# EAGLE design esp-adap (EAGLE 8.0.0)
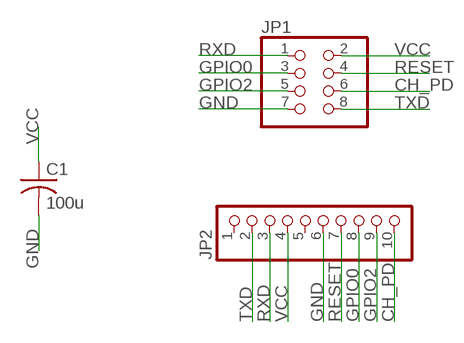
[diagram p0: schematic, sheet 1]

## Parts
C1  100u  C-USC1206K  [C1206K]
JP1  PINHD-2X4  [2X04]
JP2  PINHD-1X10  [1X10]

## Nets
CH_PD: JP1.6 JP2.10
GND: C1.2 JP1.7 JP2.6
GPIO0: JP1.3 JP2.8
GPIO2: JP1.5 JP2.9
RESET: JP1.4 JP2.7
RXD: JP1.1 JP2.3
TXD: JP1.8 JP2.2
VCC: C1.1 JP1.2 JP2.4
Unconnected: JP2.1 JP2.5

## Library data of the parts
C1 = resistor:C-US: CAPACITOR, American symbol
JP1 = pinhead:PINHD-2X4: PIN HEADER
JP2 = pinhead:PINHD-1X10: PIN HEADER

## Board
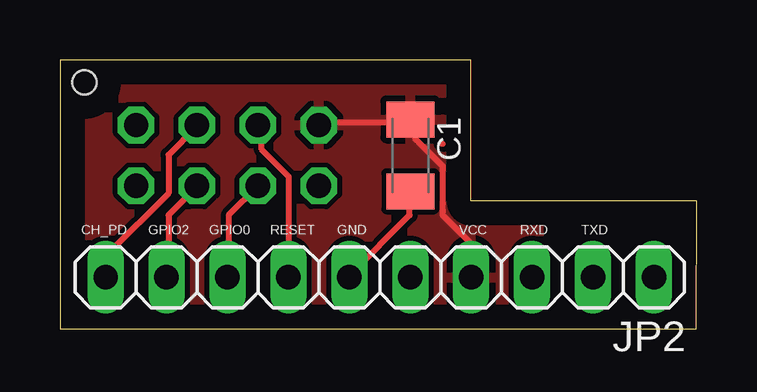
[diagram p1: board, top side]
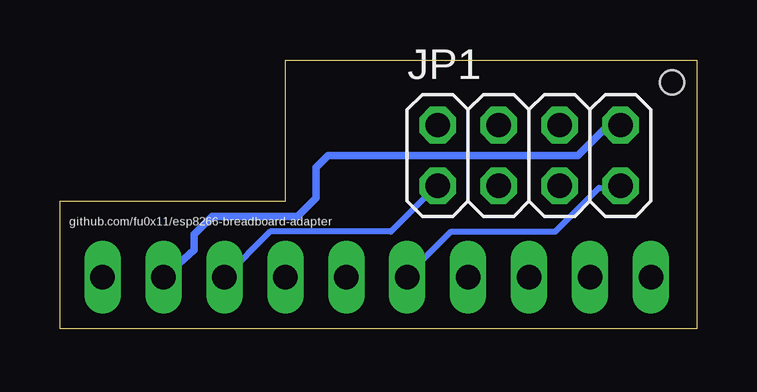
[diagram p2: board, bottom side, seen from below]

Size 26.54 x 11.23 mm. Coordinates in mm from the lower left corner, seen from the top.
Outline: 0,0 26.52,0 26.54,5.33 17.15,5.33 17.15,11.23 0,11.23 0,0
Copper layers (1*16): Top 0.035mm / dielectric 1.5mm / Bottom 0.035mm
Design rules "default": minimum track width 10mil, minimum drill 24mil, track to track 8mil, track to pad 8mil, pad to pad 8mil, via to via 8mil, smd to smd 8mil, copper to edge 40mil, drill to drill 8mil, minimum pad ring 10mil, minimum via ring 8mil, stop-mask expansion 4mil, vias tented up to drill 0mil, thermal gap 10mil
Holes 1 mm at 1.02,10.29

### Footprints (pad centres in the part's own frame; a part is rotated, then mirrored left to right if it is on the bottom)
C1206K = smd 1.5 x 2: 1 -1.5,0; 2 1.5,0
2X04 = drill 1.016 octagon: 1 -3.81,-1.27; 2 -3.81,1.27; 3 -1.27,-1.27; 4 -1.27,1.27; 5 1.27,-1.27; 6 1.27,1.27; 7 3.81,-1.27; 8 3.81,1.27
1X10 = drill 1.016 long: 1 -11.43,0; 2 -8.89,0; 3 -6.35,0; 4 -3.81,0; 5 -1.27,0; 6 1.27,0; 7 3.81,0; 8 6.35,0; 9 8.89,0; 10 11.43,0

### Placement (x,y rotation side)
C1  14.61,7.24 270 top
JP1  6.98,7.24 0 bottom
JP2  13.33,2.16 180 top

### Tracks (layer width: path | path; a pad name or v marks a point on that pad's centre or on a via)
CH_PD
  Top 0.254: JP2.10 2.01,2.24 2.01,3.15 4.52,5.66 4.52,7.26 5.66,8.41 JP1.6
GND
  Top 0.254: C1.2 14.58,5.66 14.58,4.75 12.06,2.24 JP2.6
  Bottom 0.254: JP1.7 3.38,5.89 4.06,5.89 5.89,4.06 10.24,4.06 12.06,2.24 JP2.6
GPIO0
  Top 0.254: JP1.3 7.04,4.75 7.04,2.24 JP2.8
GPIO2
  Top 0.254: JP2.9 4.52,2.24 4.52,4.75 5.66,5.89 JP1.5
N$1
  Top 0.254: 15.95,7.72 15.93,7.73
RESET
  Top 0.254: JP1.4 8.41,8.41 8.41,7.49 9.55,6.35 9.55,2.24 JP2.7
RXD
  Bottom 0.254: JP2.3 17.78,4.06 12.75,4.06 10.92,5.89 JP1.1
TXD
  Bottom 0.305: JP1.8 3.68,8.51 4.95,7.24 15.37,7.24 15.88,6.73 15.88,5.46 16.64,4.7 20.19,4.7 20.96,3.94 20.96,3.3 JP2.2
VCC
  Top 0.254: JP1.2 10.92,8.64 14.58,8.64 C1.1 14.81,8.64 14.81,7.95 15.95,6.81 15.95,4.75 17.09,3.61 17.09,2.24 JP2.4
  pour Top: 0.38,10.92 16.89,10.92 16.89,4.95 19.94,4.95 19.94,0.25 0.38,0.25

### Text on the board
tNames: CH_PD | GPIO2 | GPIO0 | RESET | GND | VCC | RXD | TXD
bNames: github.com/fu0x11/esp8266-breadboard-adapter